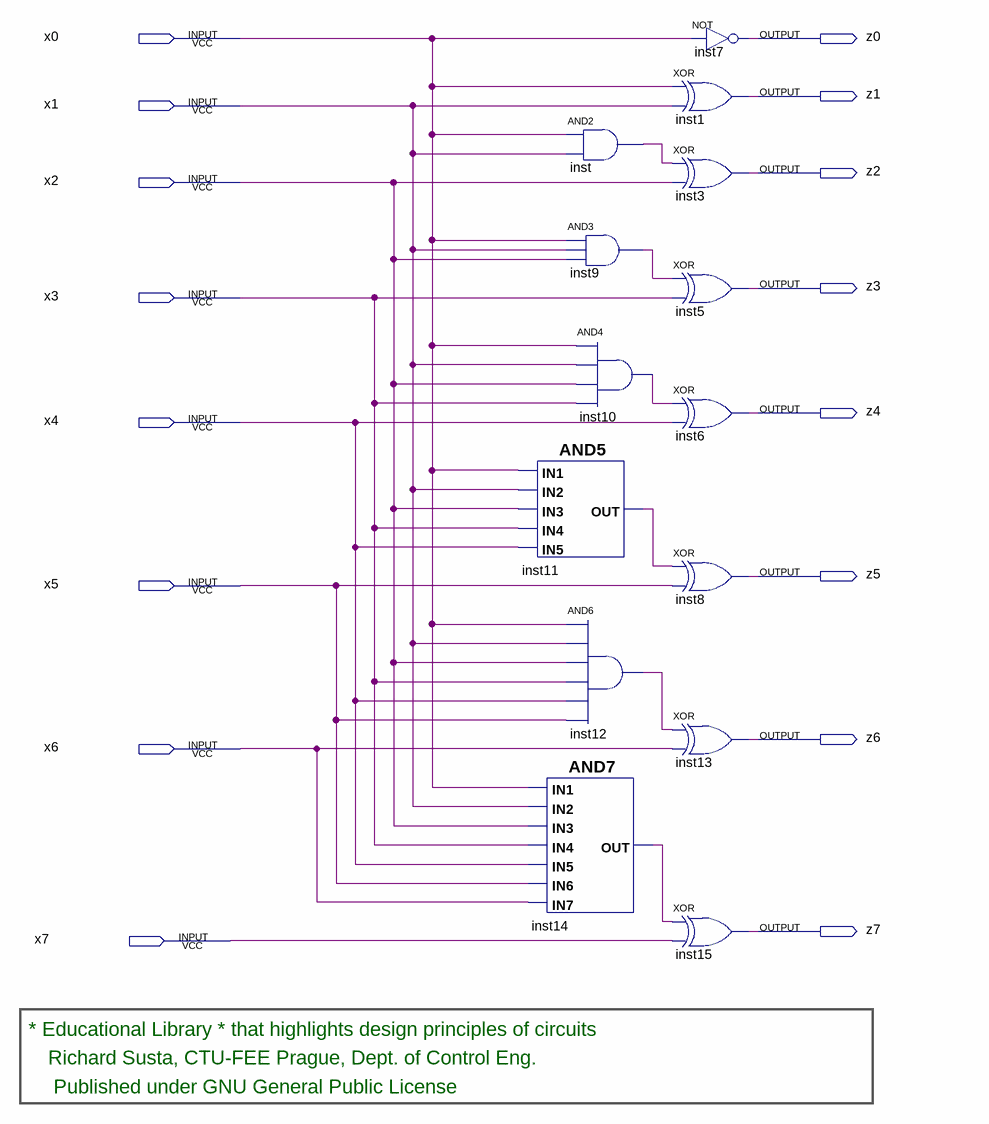
[diagram p0: schematic sheet]
// Quartus schematic add1_8bits.bdf as structural Verilog: 14 symbols, 16 pins
module add1_8bits (
  input  x0,
  input  x1,
  input  x2,
  input  x3,
  input  x4,
  input  x5,
  input  x6,
  input  x7,
  output z0,
  output z1,
  output z2,
  output z3,
  output z4,
  output z5,
  output z6,
  output z7
);

  wire inst9_out, inst10_out, inst11_out, inst12_out, inst14_out, inst_out;

  and inst (inst_out, x0, x1);
  and inst9 (inst9_out, x0, x1, x2);
  and inst10 (inst10_out, x0, x1, x2, x3);
  and inst11 (inst11_out, x0, x1, x2, x3, x4);
  and inst12 (inst12_out, x0, x1, x2, x3, x4, x5);
  and inst14 (inst14_out, x0, x1, x2, x3, x4, x5, x6);
  not inst7 (z0, x0);
  xor inst1 (z1, x0, x1);
  xor inst3 (z2, inst_out, x2);
  xor inst5 (z3, inst9_out, x3);
  xor inst6 (z4, inst10_out, x4);
  xor inst8 (z5, inst11_out, x5);
  xor inst13 (z6, inst12_out, x6);
  xor inst15 (z7, inst14_out, x7);

  // Notes on the sheet:
  //   * Educational Library * that highlights design principles of circuits
  //   Richard Susta, CTU-FEE Prague, Dept. of Control Eng. 
  //    Published under GNU General Public License
endmodule
